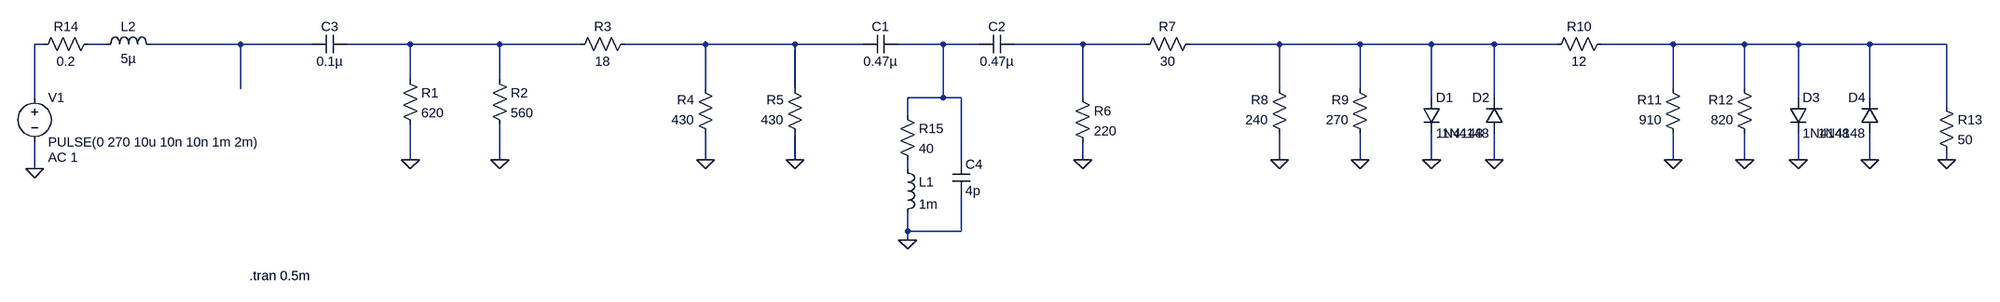
[diagram p0: schematic limiter.asc]
limiter.asc, the LTspice schematic file:
Version 4
SHEET 1 2020 680
WIRE -1552 64 -1568 64
WIRE -1440 64 -1472 64
WIRE -1200 64 -1360 64
WIRE -1072 64 -1200 64
WIRE -896 64 -1008 64
WIRE -736 64 -896 64
WIRE -592 64 -736 64
WIRE -368 64 -512 64
WIRE -208 64 -368 64
WIRE -80 64 -208 64
WIRE 64 64 -16 64
WIRE 128 64 64 64
WIRE 320 64 192 64
WIRE 432 64 320 64
WIRE 672 64 512 64
WIRE 816 64 672 64
WIRE 944 64 816 64
WIRE 1056 64 944 64
WIRE 1168 64 1056 64
WIRE 1376 64 1248 64
WIRE 1504 64 1376 64
WIRE 1600 64 1504 64
WIRE 1728 64 1600 64
WIRE 1952 64 1728 64
WIRE -896 128 -896 64
WIRE -736 128 -736 64
WIRE -1200 144 -1200 64
WIRE -368 144 -368 64
WIRE -208 144 -208 64
WIRE 672 144 672 64
WIRE 816 144 816 64
WIRE 1376 144 1376 64
WIRE 1504 144 1504 64
WIRE -1568 160 -1568 64
WIRE 64 160 64 64
WIRE 64 160 0 160
WIRE 96 160 64 160
WIRE 320 160 320 64
WIRE 944 160 944 64
WIRE 1056 160 1056 64
WIRE 1600 160 1600 64
WIRE 1728 160 1728 64
WIRE 1952 176 1952 64
WIRE 0 192 0 160
WIRE -896 272 -896 208
WIRE -736 272 -736 208
WIRE -368 272 -368 224
WIRE -208 272 -208 224
WIRE 96 272 96 160
WIRE 320 272 320 240
WIRE 672 272 672 224
WIRE 816 272 816 224
WIRE 944 272 944 224
WIRE 1056 272 1056 224
WIRE 1376 272 1376 224
WIRE 1504 272 1504 224
WIRE 1600 272 1600 224
WIRE 1728 272 1728 224
WIRE 1952 272 1952 256
WIRE -1568 288 -1568 240
WIRE 0 288 0 272
WIRE 0 400 0 368
WIRE 96 400 96 336
WIRE 96 400 0 400
WIRE 0 416 0 400
FLAG -896 272 0
FLAG -736 272 0
FLAG -368 272 0
FLAG -208 272 0
FLAG 0 416 0
FLAG 320 272 0
FLAG 672 272 0
FLAG 816 272 0
FLAG 944 272 0
FLAG 1056 272 0
FLAG 1376 272 0
FLAG 1504 272 0
FLAG 1600 272 0
FLAG 1728 272 0
FLAG 1952 272 0
FLAG -1568 288 0
SYMBOL res -912 112 R0
SYMATTR InstName R1
SYMATTR Value 620
SYMBOL res -752 112 R0
SYMATTR InstName R2
SYMATTR Value 560
SYMBOL res -496 48 R90
WINDOW 0 0 56 VBottom 2
WINDOW 3 32 56 VTop 2
SYMATTR InstName R3
SYMATTR Value 18
SYMBOL res -352 240 R180
WINDOW 0 36 76 Left 2
WINDOW 3 36 40 Left 2
SYMATTR InstName R4
SYMATTR Value 430
SYMBOL res -192 240 R180
WINDOW 0 36 76 Left 2
WINDOW 3 36 40 Left 2
SYMATTR InstName R5
SYMATTR Value 430
SYMBOL cap -16 48 R90
WINDOW 0 0 32 VBottom 2
WINDOW 3 32 32 VTop 2
SYMATTR InstName C1
SYMATTR Value 0.47µ
SYMBOL ind -16 272 R0
SYMATTR InstName L1
SYMATTR Value 1m
SYMBOL cap 192 48 R90
WINDOW 0 0 32 VBottom 2
WINDOW 3 32 32 VTop 2
SYMATTR InstName C2
SYMATTR Value 0.47µ
SYMBOL res 304 144 R0
SYMATTR InstName R6
SYMATTR Value 220
SYMBOL res 528 48 R90
WINDOW 0 0 56 VBottom 2
WINDOW 3 32 56 VTop 2
SYMATTR InstName R7
SYMATTR Value 30
SYMBOL res 688 240 R180
WINDOW 0 36 76 Left 2
WINDOW 3 36 40 Left 2
SYMATTR InstName R8
SYMATTR Value 240
SYMBOL res 832 240 R180
WINDOW 0 36 76 Left 2
WINDOW 3 36 40 Left 2
SYMATTR InstName R9
SYMATTR Value 270
SYMBOL diode 928 160 R0
SYMATTR InstName D1
SYMATTR Value 1N4148
SYMBOL diode 1072 224 R180
WINDOW 0 24 64 Left 2
WINDOW 3 24 0 Left 2
SYMATTR InstName D2
SYMATTR Value 1N4148
SYMBOL res 1264 48 R90
WINDOW 0 0 56 VBottom 2
WINDOW 3 32 56 VTop 2
SYMATTR InstName R10
SYMATTR Value 12
SYMBOL res 1392 240 R180
WINDOW 0 36 76 Left 2
WINDOW 3 36 40 Left 2
SYMATTR InstName R11
SYMATTR Value 910
SYMBOL res 1520 240 R180
WINDOW 0 36 76 Left 2
WINDOW 3 36 40 Left 2
SYMATTR InstName R12
SYMATTR Value 820
SYMBOL diode 1584 160 R0
SYMATTR InstName D3
SYMATTR Value 1N4148
SYMBOL diode 1744 224 R180
WINDOW 0 24 64 Left 2
WINDOW 3 24 0 Left 2
SYMATTR InstName D4
SYMATTR Value 1N4148
SYMBOL cap -1008 48 R90
WINDOW 0 0 32 VBottom 2
WINDOW 3 32 32 VTop 2
SYMATTR InstName C3
SYMATTR Value 0.1µ
SYMBOL res 1936 160 R0
SYMATTR InstName R13
SYMATTR Value 50
SYMBOL voltage -1568 144 R0
WINDOW 123 24 124 Left 2
WINDOW 39 0 0 Left 0
SYMATTR Value2 AC 1
SYMATTR InstName V1
SYMATTR Value PULSE(0 270 10u 10n 10n 1m 2m)
SYMBOL res -1456 48 R90
WINDOW 0 0 56 VBottom 2
WINDOW 3 32 56 VTop 2
SYMATTR InstName R14
SYMATTR Value 0.2
SYMBOL ind -1456 80 R270
WINDOW 0 32 56 VTop 2
WINDOW 3 5 56 VBottom 2
SYMATTR InstName L2
SYMATTR Value 5µ
SYMBOL res -16 176 R0
SYMATTR InstName R15
SYMATTR Value 40
SYMBOL cap 80 272 R0
SYMATTR InstName C4
SYMATTR Value 4p
TEXT -1184 480 Left 2 !.tran 0.5m

The netlist it stands for:
* limiter.asc
R1 N004 0 620
R2 N004 0 560
R3 N005 N004 18
R4 0 N005 430
R5 0 N005 430
C1 N006 N005 0.47µ
L1 N010 0 1m
C2 N007 N006 0.47µ
R6 N007 0 220
R7 N008 N007 30
R8 0 N008 240
R9 0 N008 270
D1 N008 0 1N4148
D2 0 N008 1N4148
R10 N009 N008 12
R11 0 N009 910
R12 0 N009 820
D3 N009 0 1N4148
D4 0 N009 1N4148
C3 N004 N003 0.1µ
R13 N009 0 50
V1 N001 0 PULSE(0 270 10u 10n 10n 1m 2m) AC 1
R14 N002 N001 0.2
L2 N002 N003 5µ
R15 N006 N010 40
C4 N006 0 4p
.model D D
.lib standard.dio
.tran 0.5m
.backanno
.end